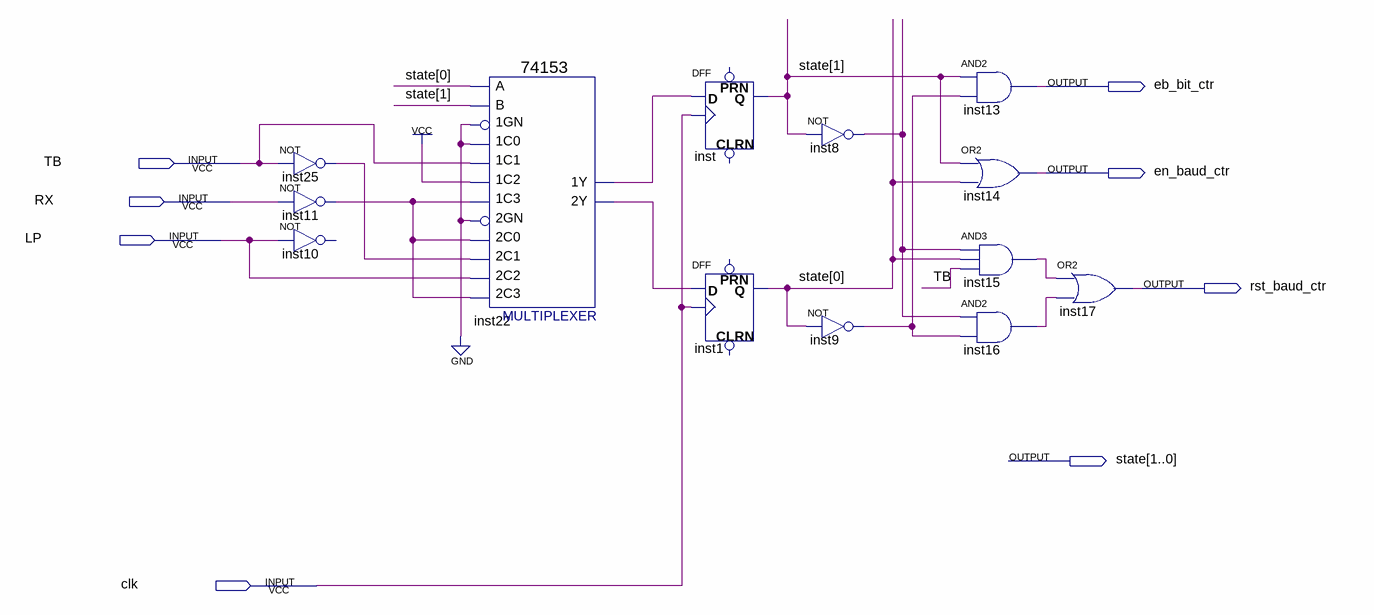
[diagram p0: schematic sheet]
// Quartus schematic state_machine.bdf as structural Verilog: 13 symbols, 8 pins
module state_machine (
  input  TB,
  input  RX,
  input  LP,
  input  clk,
  output eb_bit_ctr,
  output en_baud_ctr,
  output rst_baud_ctr,
  output [1:0] state
);

  wire inst8_out, inst9_out, inst11_out, inst15_out, inst16_out, inst22_1y, inst22_2y, inst25_out;

  not inst25 (inst25_out, TB);
  not inst11 (inst11_out, RX);
  // NOT inst10 has open pins: IN=LP, OUT=open
  \74153  inst22 (
    .\1C1 (TB), .\1GN (1'b0), .\1C0 (1'b0), .\2C0 (inst11_out), .\2GN (1'b0), .\2C2 (LP), .\1C2 (1'b1),
    .\1C3 (inst11_out), .B(state[1]), .A(state[0]), .\2C1 (inst25_out), .\2C3 (inst11_out), .\1Y (inst22_1y),
    .\2Y (inst22_2y));
  DFF inst (.CLK(clk), .D(inst22_1y), .Q(state[1]));  // open: CLRN, PRN
  DFF inst1 (.CLK(clk), .D(inst22_2y), .Q(state[0]));  // open: CLRN, PRN
  not inst8 (inst8_out, state[1]);
  not inst9 (inst9_out, state[0]);
  and inst13 (eb_bit_ctr, state[1], inst9_out);
  or inst14 (en_baud_ctr, state[1], state[0]);
  and inst15 (inst15_out, inst8_out, state[0], TB);
  and inst16 (inst16_out, inst8_out, inst9_out);
  or inst17 (rst_baud_ctr, inst15_out, inst16_out);
endmodule
